# EasyEDA Pro project Board1.epro

# Schematic Schematic1
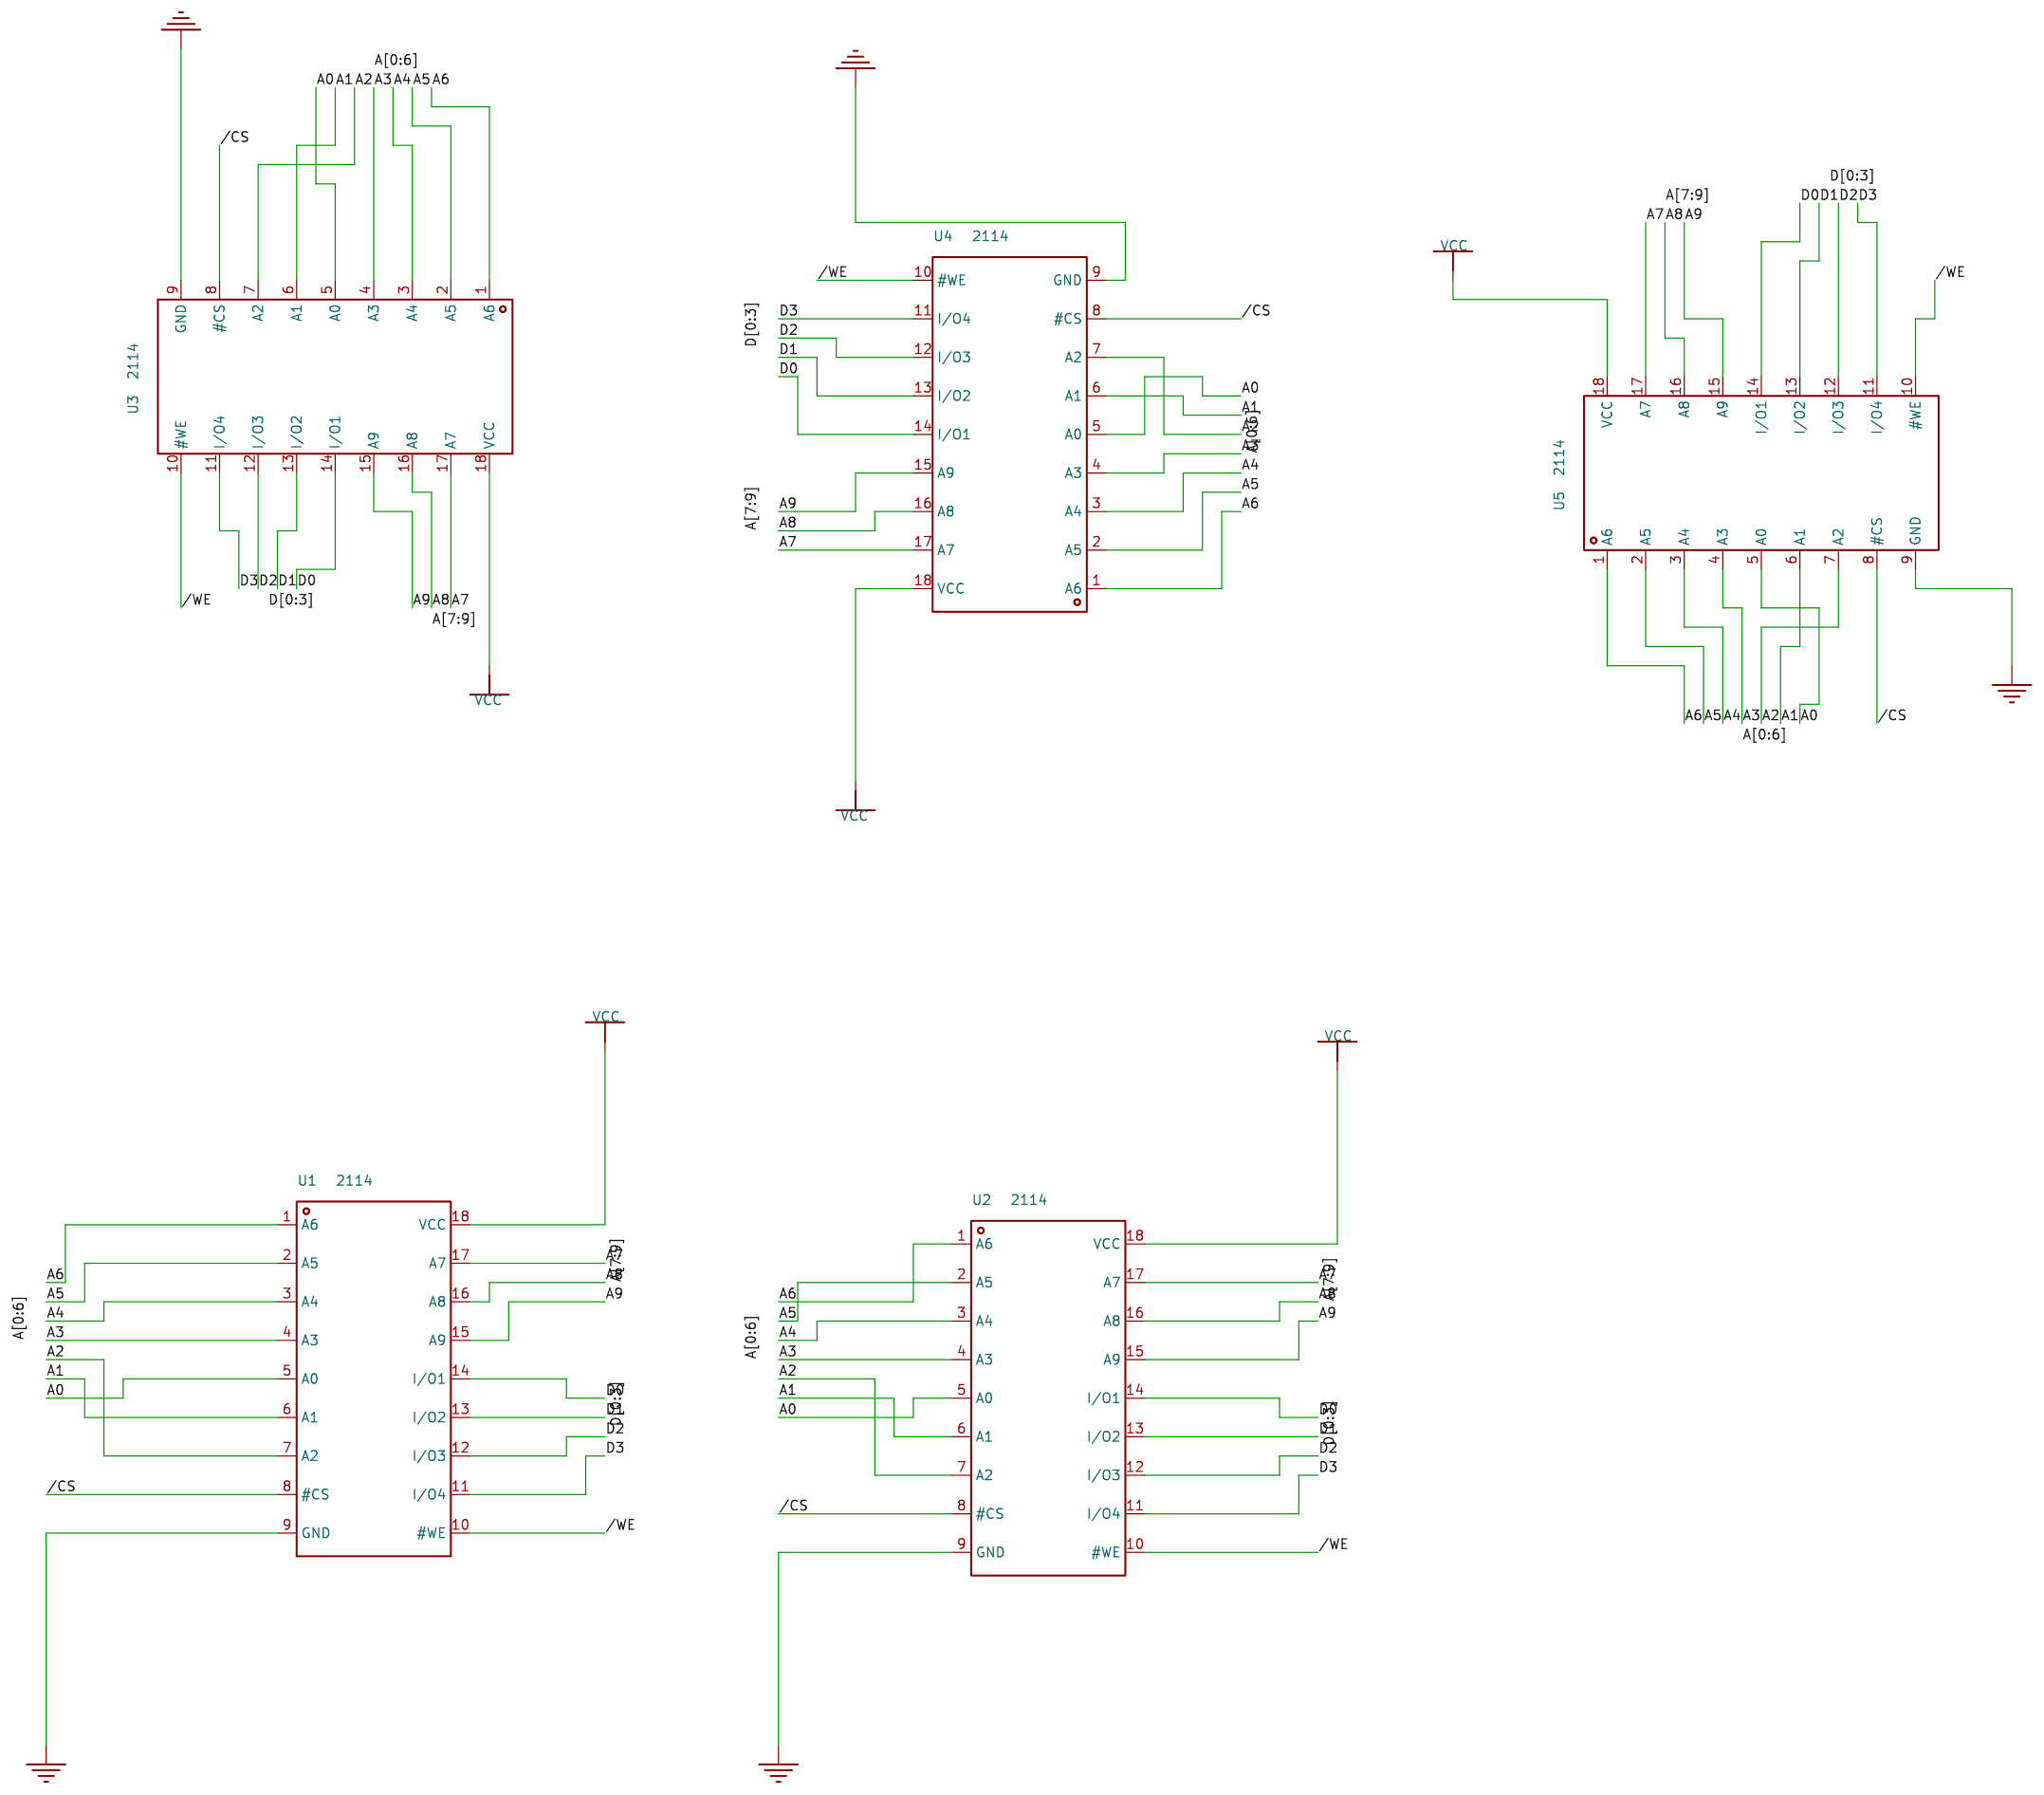
[diagram p0: schematic sheet]

## Parts
U1  2114  [DIP-18_L23.0-W6.5-P2.54-LS7.6-BL]
U2  2114  [DIP-18_L23.0-W6.5-P2.54-LS7.6-BL]
U3  2114  [DIP-18_L23.0-W6.5-P2.54-LS7.6-BL]
U4  2114  [DIP-18_L23.0-W6.5-P2.54-LS7.6-BL]
U5  2114  [DIP-18_L23.0-W6.5-P2.54-LS7.6-BL]

## Library data of the parts
U1-U5 = 2114: DIP-18 IC; Supplier Part: C127026; Manufacturer: UTC; Supplier Footprint: DIP-18; JLCPCB Part Class: Extended Part; Supplier: LCSC

## Nets
GND: U1.9(GND) U2.9(GND) U3.9(GND) U4.9(GND) U5.9(GND)
VCC: U1.18(VCC) U2.18(VCC) U3.18(VCC) U4.18(VCC) U5.18(VCC)
/CS: U1.8(#CS) U2.8(#CS) U3.8(#CS) U4.8(#CS) U5.8(#CS)
/WE: U1.10(#WE) U2.10(#WE) U3.10(#WE) U4.10(#WE) U5.10(#WE)
A0: U1.5(A0) U2.5(A0) U3.5(A0) U4.5(A0) U5.5(A0)
A1: U1.6(A1) U2.6(A1) U3.6(A1) U4.6(A1) U5.6(A1)
A2: U1.7(A2) U2.7(A2) U3.7(A2) U4.7(A2) U5.7(A2)
A3: U1.4(A3) U2.4(A3) U3.4(A3) U4.4(A3) U5.4(A3)
A4: U1.3(A4) U2.3(A4) U3.3(A4) U4.3(A4) U5.3(A4)
A5: U1.2(A5) U2.2(A5) U3.2(A5) U4.2(A5) U5.2(A5)
A6: U1.1(A6) U2.1(A6) U3.1(A6) U4.1(A6) U5.1(A6)
A7: U1.17(A7) U2.17(A7) U3.17(A7) U4.17(A7) U5.17(A7)
A8: U1.16(A8) U2.16(A8) U3.16(A8) U4.16(A8) U5.16(A8)
A9: U1.15(A9) U2.15(A9) U3.15(A9) U4.15(A9) U5.15(A9)
D0: U1.14(I/O1) U2.14(I/O1) U3.14(I/O1) U4.14(I/O1) U5.14(I/O1)
D1: U1.13(I/O2) U2.13(I/O2) U3.13(I/O2) U4.13(I/O2) U5.13(I/O2)
D2: U1.12(I/O3) U2.12(I/O3) U3.12(I/O3) U4.12(I/O3) U5.12(I/O3)
D3: U1.11(I/O4) U2.11(I/O4) U3.11(I/O4) U4.11(I/O4) U5.11(I/O4)
